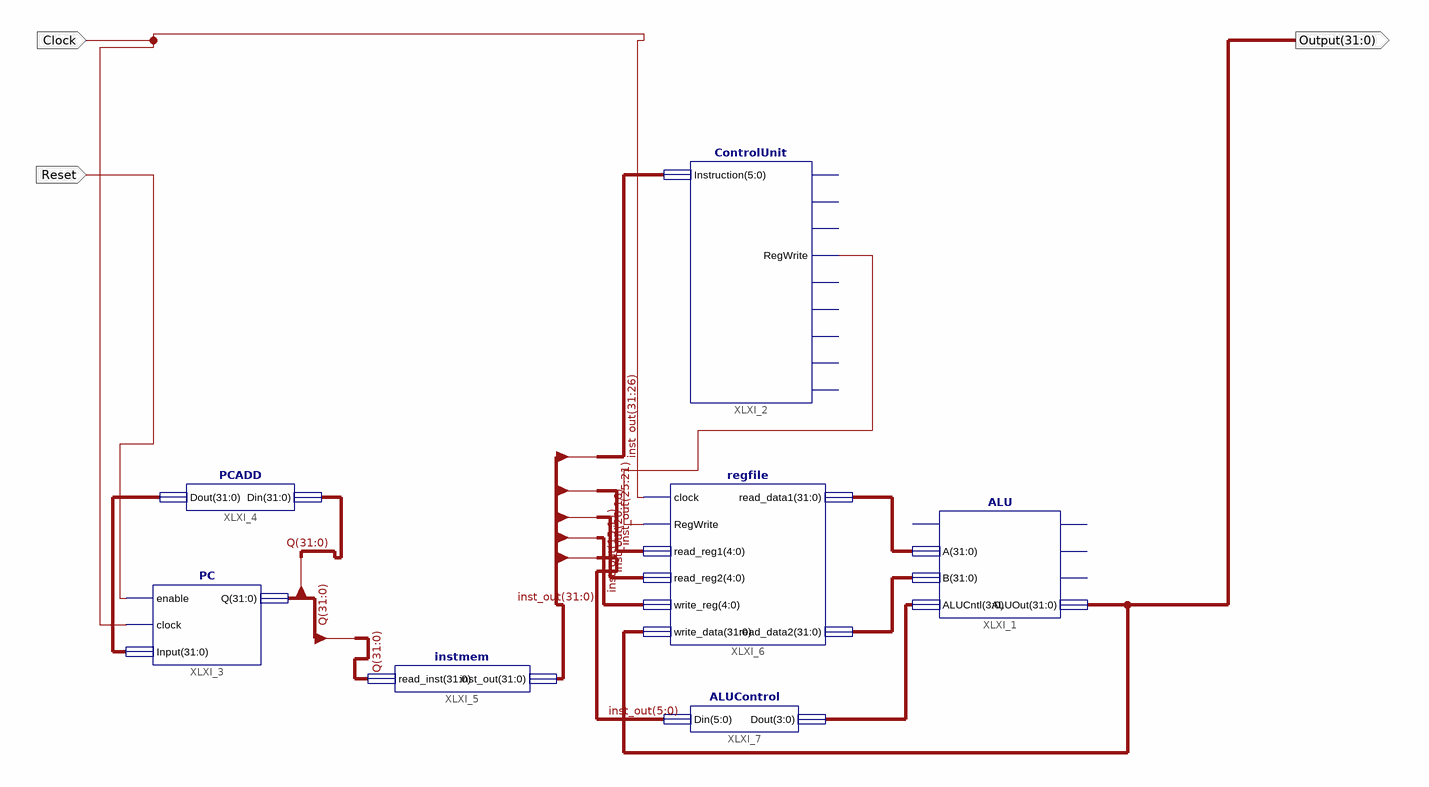
[diagram p0: schematic sheet 1]
// Xilinx ISE schematic DataPath.sch (spartan3e) as structural Verilog: 7 symbols, 3 ports
module DataPath (
  input  Clock,
  input  Reset,
  output [31:0] Output
);

  wire XLXN_22;
  wire [3:0] XLXN_19;
  wire [31:0] inst_out, Q, XLXN_20, XLXN_21, XLXN_27;

  ALU XLXI_1 (.A(XLXN_20), .B(XLXN_21), .ALUCntl(XLXN_19), .ALUOut(Output));  // open: Carryin, Zero, Carryout, Overflow
  ControlUnit XLXI_2 (
    .Instruction(inst_out[31:26]), .RegWrite(XLXN_22));  // open: RegDst, ALUSrc, MemtoReg, MemRead, MemWrite, Branch, ALUop1, ALUop0
  PC XLXI_3 (.enable(Reset), .clock(Clock), .Input(XLXN_27), .Q(Q));
  PCADD XLXI_4 (.Din(Q), .Dout(XLXN_27));
  instmem XLXI_5 (.read_inst(Q), .inst_out(inst_out));
  regfile XLXI_6 (
    .clock(Clock), .RegWrite(XLXN_22), .read_reg1(inst_out[25:21]), .read_reg2(inst_out[20:16]),
    .write_reg(inst_out[15:11]), .write_data(Output), .read_data1(XLXN_20), .read_data2(XLXN_21));
  ALUControl XLXI_7 (.Din(inst_out[5:0]), .Dout(XLXN_19));
endmodule
